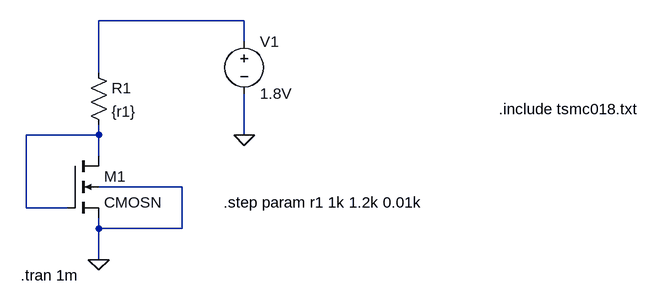
[diagram p0: schematic 0204.asc]
0204.asc, the LTspice schematic file:
Version 4
SHEET 1 1016 680
WIRE 384 -32 160 -32
WIRE 384 0 384 -32
WIRE 160 48 160 -32
WIRE 160 144 160 128
WIRE 160 144 48 144
WIRE 384 144 384 80
WIRE 160 176 160 144
WIRE 288 224 160 224
WIRE 48 256 48 144
WIRE 112 256 48 256
WIRE 160 288 160 272
WIRE 288 288 288 224
WIRE 288 288 160 288
WIRE 160 336 160 288
FLAG 160 336 0
FLAG 384 144 0
SYMBOL res 144 32 R0
SYMATTR InstName R1
SYMATTR Value {r1}
SYMBOL voltage 384 -16 R0
WINDOW 123 0 0 Left 0
WINDOW 39 0 0 Left 0
SYMATTR InstName V1
SYMATTR Value 1.8V
SYMBOL nmos4 112 176 R0
SYMATTR InstName M1
SYMATTR Value CMOSN
SYMATTR Value2 l=500n w=1u
TEXT 40 360 Left 2 !.tran 1m
TEXT 352 248 Left 2 !.step param r1 1k 1.2k 0.01k
TEXT 776 104 Left 2 !.include tsmc018.txt

The netlist it stands for:
* 0204.asc
R1 N001 N002 {r1}
V1 N001 0 1.8V
M1 N002 N002 0 0 CMOSN l=500n w=1u
.model NMOS NMOS
.model PMOS PMOS
.lib standard.mos
.tran 1m
.step param r1 1k 1.2k 0.01k
.include tsmc018.txt
.backanno
.end